# Altium schematic sheet Gate_Driver.SchDoc
size A; SheetNumber: 2; SheetTotal: 3
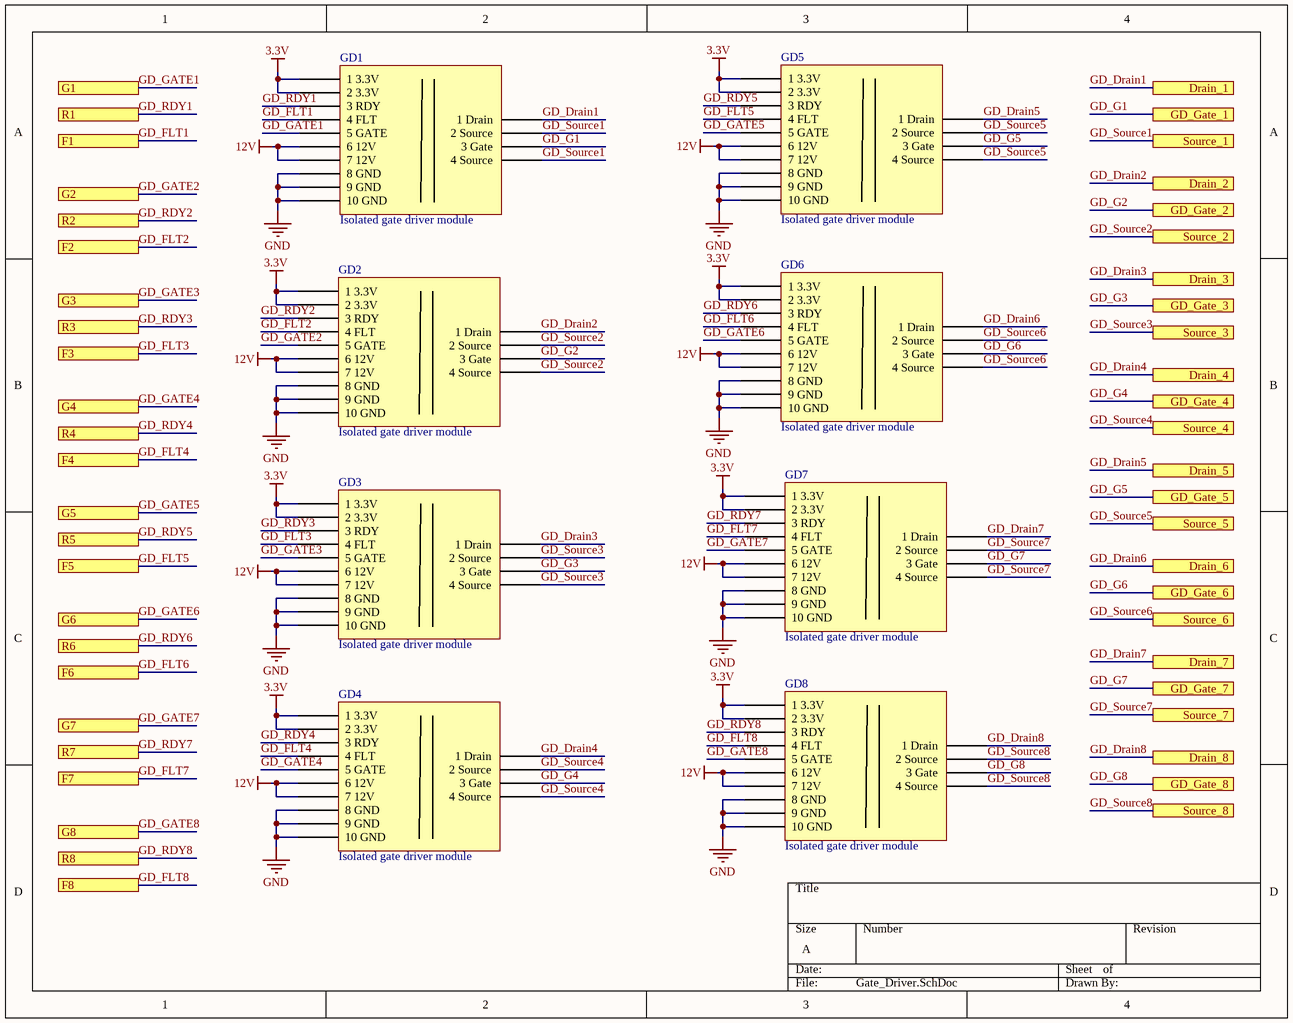
[diagram p0: Gate_Driver.SchDoc]

## Parts
GD1  Isolated gate driver module  [Gate_Driver_horizontal]
GD2  Isolated gate driver module  [Gate_Driver_horizontal]
GD3  Isolated gate driver module  [Gate_Driver_horizontal]
GD4  Isolated gate driver module  [Gate_Driver_horizontal]
GD5  Isolated gate driver module  [Gate_Driver_horizontal]
GD6  Isolated gate driver module  [Gate_Driver_horizontal]
GD7  Isolated gate driver module  [Gate_Driver_horizontal]
GD8  Isolated gate driver module  [Gate_Driver_horizontal]

## Ports
Drain_1 (see Power Topology[2C]), Drain_2 (see Power Topology[2C]), Drain_3 (see Power Topology[2C]), Drain_4 (see Power Topology[2C]), Drain_5 (see Power Topology[2C]), Drain_6 (see Power Topology[2D]), Drain_7 (see Power Topology[2D]), Drain_8 (see Power Topology[2D]), F1 (see Power Topology[2C]), F2 (see Power Topology[2C]), F3 (see Power Topology[2C]), F4 (see Power Topology[2C]), F5 (see Power Topology[2C]), F6 (see Power Topology[2D]), F7 (see Power Topology[2D]), F8 (see Power Topology[2D]), G1 (see Power Topology[2C]), G2 (see Power Topology[2C]), G3 (see Power Topology[2C]), G4 (see Power Topology[2C]), G5 (see Power Topology[2C]), G6 (see Power Topology[2C]), G7 (see Power Topology[2D]), G8 (see Power Topology[2D]), GD_Gate_1 (see Power Topology[2C]), GD_Gate_2 (see Power Topology[2C]), GD_Gate_3 (see Power Topology[2C]), GD_Gate_4 (see Power Topology[2C]), GD_Gate_5 (see Power Topology[2C]), GD_Gate_6 (see Power Topology[2C]), GD_Gate_7 (see Power Topology[2D]), GD_Gate_8 (see Power Topology[2D]), R1 (see Power Topology[2C]), R2 (see Power Topology[2C]), R3 (see Power Topology[2C]), R4 (see Power Topology[2C]), R5 (see Power Topology[2C]), R6 (see Power Topology[2D]), R7 (see Power Topology[2D]), R8 (see Power Topology[2D]), Source_1 (see Power Topology[2C]), Source_2 (see Power Topology[2C]), Source_3 (see Power Topology[2C]), Source_4 (see Power Topology[2C]), Source_5 (see Power Topology[2C]), Source_6 (see Power Topology[2D]), Source_7 (see Power Topology[2D]), Source_8 (see Power Topology[2D])

## Nets
3.3V: GD1.1(1_3.3V) GD1.2(2_3.3V) GD2.1(1_3.3V) GD2.2(2_3.3V) GD3.1(1_3.3V) GD3.2(2_3.3V) GD4.1(1_3.3V) GD4.2(2_3.3V) GD5.1(1_3.3V) GD5.2(2_3.3V) GD6.1(1_3.3V) GD6.2(2_3.3V) GD7.1(1_3.3V) GD7.2(2_3.3V) GD8.1(1_3.3V) GD8.2(2_3.3V)
12V: GD1.6(6_12V) GD1.7(7_12V) GD2.6(6_12V) GD2.7(7_12V) GD3.6(6_12V) GD3.7(7_12V) GD4.6(6_12V) GD4.7(7_12V) GD5.6(6_12V) GD5.7(7_12V) GD6.6(6_12V) GD6.7(7_12V) GD7.6(6_12V) GD7.7(7_12V) GD8.6(6_12V) GD8.7(7_12V)
GND: GD1.8(8_GND) GD1.9(9_GND) GD1.10(10_GND) GD2.8(8_GND) GD2.9(9_GND) GD2.10(10_GND) GD3.8(8_GND) GD3.9(9_GND) GD3.10(10_GND) GD4.8(8_GND) GD4.9(9_GND) GD4.10(10_GND) GD5.8(8_GND) GD5.9(9_GND) GD5.10(10_GND) GD6.8(8_GND) GD6.9(9_GND) GD6.10(10_GND) GD7.8(8_GND) GD7.9(9_GND) GD7.10(10_GND) GD8.8(8_GND) GD8.9(9_GND) GD8.10(10_GND)
GD_Drain1: GD1.11(1_Drain) ; port Drain_1
GD_Drain2: GD2.11(1_Drain) ; port Drain_2
GD_Drain3: GD3.11(1_Drain) ; port Drain_3
GD_Drain4: GD4.11(1_Drain) ; port Drain_4
GD_Drain5: GD5.11(1_Drain) ; port Drain_5
GD_Drain6: GD6.11(1_Drain) ; port Drain_6
GD_Drain7: GD7.11(1_Drain) ; port Drain_7
GD_Drain8: GD8.11(1_Drain) ; port Drain_8
GD_FLT1: GD1.4(4_FLT) ; port F1
GD_FLT2: GD2.4(4_FLT) ; port F2
GD_FLT3: GD3.4(4_FLT) ; port F3
GD_FLT4: GD4.4(4_FLT) ; port F4
GD_FLT5: GD5.4(4_FLT) ; port F5
GD_FLT6: GD6.4(4_FLT) ; port F6
GD_FLT7: GD7.4(4_FLT) ; port F7
GD_FLT8: GD8.4(4_FLT) ; port F8
GD_G1: GD1.13(3_Gate) ; port GD_Gate_1
GD_G2: GD2.13(3_Gate) ; port GD_Gate_2
GD_G3: GD3.13(3_Gate) ; port GD_Gate_3
GD_G4: GD4.13(3_Gate) ; port GD_Gate_4
GD_G5: GD5.13(3_Gate) ; port GD_Gate_5
GD_G6: GD6.13(3_Gate) ; port GD_Gate_6
GD_G7: GD7.13(3_Gate) ; port GD_Gate_7
GD_G8: GD8.13(3_Gate) ; port GD_Gate_8
GD_GATE1: GD1.5(5_GATE) ; port G1
GD_GATE2: GD2.5(5_GATE) ; port G2
GD_GATE3: GD3.5(5_GATE) ; port G3
GD_GATE4: GD4.5(5_GATE) ; port G4
GD_GATE5: GD5.5(5_GATE) ; port G5
GD_GATE6: GD6.5(5_GATE) ; port G6
GD_GATE7: GD7.5(5_GATE) ; port G7
GD_GATE8: GD8.5(5_GATE) ; port G8
GD_RDY1: GD1.3(3_RDY) ; port R1
GD_RDY2: GD2.3(3_RDY) ; port R2
GD_RDY3: GD3.3(3_RDY) ; port R3
GD_RDY4: GD4.3(3_RDY) ; port R4
GD_RDY5: GD5.3(3_RDY) ; port R5
GD_RDY6: GD6.3(3_RDY) ; port R6
GD_RDY7: GD7.3(3_RDY) ; port R7
GD_RDY8: GD8.3(3_RDY) ; port R8
GD_Source1: GD1.12(2_Source) GD1.14(4_Source) ; port Source_1
GD_Source2: GD2.12(2_Source) GD2.14(4_Source) ; port Source_2
GD_Source3: GD3.12(2_Source) GD3.14(4_Source) ; port Source_3
GD_Source4: GD4.12(2_Source) GD4.14(4_Source) ; port Source_4
GD_Source5: GD5.12(2_Source) GD5.14(4_Source) ; port Source_5
GD_Source6: GD6.12(2_Source) GD6.14(4_Source) ; port Source_6
GD_Source7: GD7.12(2_Source) GD7.14(4_Source) ; port Source_7
GD_Source8: GD8.12(2_Source) GD8.14(4_Source) ; port Source_8

## Library data of the parts
GD1-GD8 = Con_Isolated_gate_driver_module: 10 + 4 Position Receptacle Connector 0.079" (2.00mm) Through Hole Gold; MPN 10pos: SMM-110-01-S-S; MPN 4pos: SMM-104-01-S-S; MF: Samtec Inc.; Created: 2021_07_07_DArancibia; Package: Through Hole, pitch 0.079" (2.00mm); Value: Isolated gate driver module; Supplier 1: Digi-Key; Supplier Part Number 1: SAM11825-ND